# EAGLE design 2AD66-SMA (EAGLE 9.6.2)
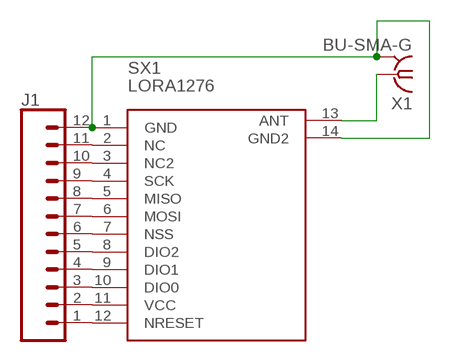
[diagram p0: schematic, sheet 1]

## Parts
J1  CONN_12  [1X12]
SX1  LORA1276  [PCBV2]
X1  BU-SMA-G  [BU-SMA-G]

## Nets
N$1: J1.11 SX1.2(NC)
N$2: J1.10 SX1.3(NC2)
N$3: J1.9 SX1.4(SCK)
N$4: J1.8 SX1.5(MISO)
N$5: J1.7 SX1.6(MOSI)
N$6: J1.6 SX1.7(NSS)
N$7: J1.5 SX1.8(DIO2)
N$8: J1.4 SX1.9(DIO1)
N$9: J1.3 SX1.10(DIO0)
N$10: J1.2 SX1.11(VCC)
N$11: J1.1 SX1.12(NRESET)
N$12: J1.12 SX1.1(GND) SX1.14(GND2) X1.2 X1.3 X1.4 X1.5
N$13: SX1.13(ANT) X1.1

## Library data of the parts
J1 = SparkFun-Connectors:CONN_12: Multi connection point. Often used as Generic Header-pin footprint for 0.1 inch spaced/style header connections On any of the 0.1 inch spaced packages, you can populate with these: Break Away Headers - Straight <https://www.sparkfun.com/products/116> (PRT-00116) Break Away Male Headers - Right Angle <https://www.sparkfun.com/products/553> (PRT-00553) Female Headers <https://www.sparkfun.com/products/115> (PRT-00115) Break Away Headers - Machine Pin <https://www.sparkfun.com/products/117> (PRT-00117) Break Away Female Headers - Swiss Machine Pin <https://www.sparkfun.com/products/743> (PRT-00743) For SCREWTERMINALS and SPRING TERMINALS visit here: Screw Terimnals on SparkFun.com <https://www.sparkfun.com/search/results?term=Screw+Terminals> (5mm/3.5mm/2.54mm spacing) This device is also useful as a general connection point to wire up your design to another part of your project. Our various solder wires solder well into these plated through hole pads. Hook-Up Wire - Assortment (Stranded, 22 AWG) <https://www.sparkfun.com/products/11375> (PRT-11375) Hook-Up Wire - Assortment (Solid Core, 22 AWG) <https://www.sparkfun.com/products/11367> (PRT-11367) View the entire wire category on our website here <https://www.sparkfun.com/categories/141> Special notes: Molex polarized connector foot print use with SKU : PRT-08231 with associated crimp pins and housings. 1MM SMD Version SKU: PRT-10208 NOTES ON THE VARIANTS LOCK and LOCK_LONGPADS... This footprint was designed to help hold the alignment of a through-hole component (i.e. 6-pin header) while soldering it into place. You may notice that each hole has been shifted either up or down by 0.005 of an inch from it's more standard position (which is a perfectly straight line). This slight alteration caused the pins (the squares in the middle) to touch the edges of the holes. Because they are alternating, it causes a "brace" to hold the component in place. 0.005 has proven to be the perfect amount of "off-center" position when using our standard breakaway headers. Although looks a little odd when you look at the bare footprint, once you have a header in there, the alteration is very hard to notice. Also,if you push a header all the way into place, it is covered up entirely on the bottom side.
SX1 = Lora1276V2NiceRF:LORA1276
X1 = con-coax:BU-SMA-G: FEMALE SMA CONNECTOR Radiall distributor RS 193-9117; OC_FARNELL: unknown; OC_NEWARK: unknown

## Board
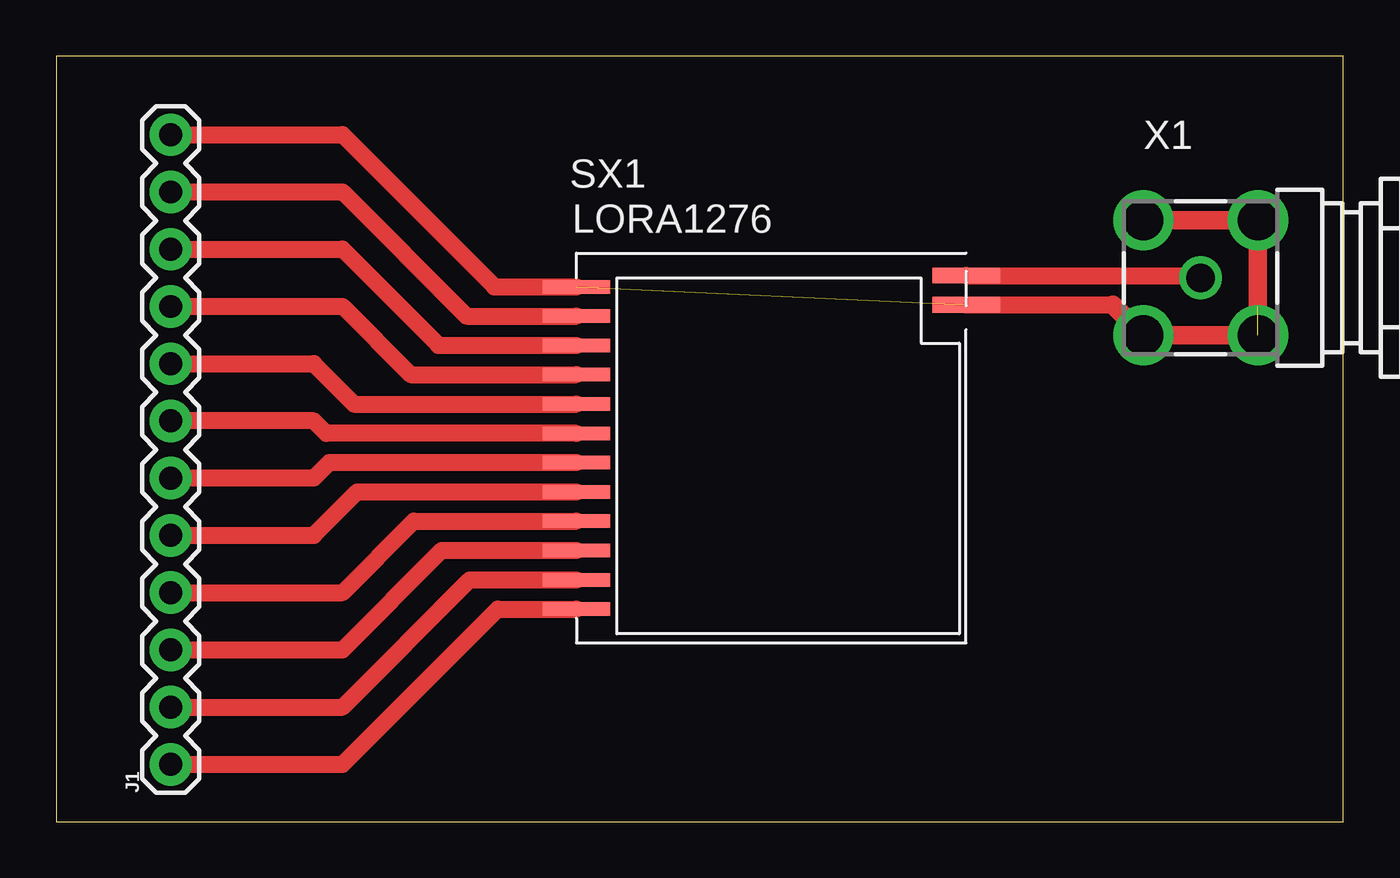
[diagram p1: board, top side]

Size 57.13 x 33.96 mm. Coordinates in mm from the lower left corner, seen from the top.
Outline: 0,0 57.13,0 57.13,33.96 0,33.96 0,0
Copper layers (1*16): Top 0.035mm / dielectric 1.5mm / Bottom 0.035mm
Design rules "default": minimum track width 6mil, minimum drill 0.35mm, track to track 6mil, track to pad 6mil, pad to pad 6mil, via to via 6mil, smd to smd 6mil, copper to edge 40mil, drill to drill 6mil, minimum pad ring 10mil, minimum via ring 8mil, stop-mask expansion 4mil, vias tented up to drill 0mil, thermal gap 10mil

### Footprints (pad centres in the part's own frame; a part is rotated, then mirrored left to right if it is on the bottom)
1X12 = drill 1.016 pad 1.88: 1 0,0; 2 2.54,0; 3 5.08,0; 4 7.62,0; 5 10.16,0; 6 12.7,0; 7 15.24,0; 8 17.78,0; 9 20.32,0; 10 22.86,0; 11 25.4,0; 12 27.94,0
PCBV2 = smd 3 x 0.6: 1 1.5,-0.4; 2 1.5,-1.7; 3 1.5,-3; 4 1.5,-4.3; 5 1.5,-5.6; 6 1.5,-6.9; 7 1.5,-8.2; 8 1.5,-9.5; 9 1.5,-10.8; 10 1.5,-12.1; 11 1.5,-13.4; 12 1.5,-14.7 | smd 3 x 0.7: 13 18.8,0.1; 14 18.8,-1.2
BU-SMA-G = drill 1.27: 1 0,0 | drill 1.778: 2 -2.55,2.55; 3 2.55,2.55; 4 2.55,-2.55; 5 -2.55,-2.55

### Placement (x,y rotation side)
J1  5.08,2.54 90 top
SX1  21.59,24.13 0 top
X1  50.8,24.13 0 top

### Tracks (layer width: path | path; a pad name or v marks a point on that pad's centre or on a via)
N$1
  Top 0.762: J1.11 12.7,27.94 18.21,22.43 SX1.2
N$2
  Top 0.762: J1.10 12.7,25.4 16.97,21.13 SX1.3
N$3
  Top 0.762: J1.9 12.7,22.86 15.73,19.83 SX1.4
N$4
  Top 0.762: J1.8 11.43,20.32 13.22,18.53 SX1.5
N$5
  Top 0.762: SX1.6 11.98,17.23 11.43,17.78 J1.7
N$6
  Top 0.762: SX1.7 12.12,15.93 11.43,15.24 J1.6
N$7
  Top 0.762: SX1.8 13.36,14.63 11.43,12.7 J1.5
N$8
  Top 0.762: SX1.9 15.87,13.33 12.7,10.16 J1.4
N$9
  Top 0.762: SX1.10 17.11,12.03 12.7,7.62 J1.3
N$10
  Top 0.762: J1.2 12.7,5.08 18.35,10.73 SX1.11
N$11
  Top 0.762: SX1.12 19.59,9.43 12.7,2.54 J1.1
N$12  (2 unrouted)
  Top 0.762: J1.12 12.7,30.48 19.45,23.73 SX1.1 | SX1.14 46.9,22.93
  Top 0.813: 46.9,22.93 X1.5 52.07,21.58 | 52.07,21.58 X1.4 | 53.35,22.86 X1.3 X1.2 | 52.08,21.59 52.07,21.58
N$13
  Top 0.762: SX1.13 50.7,24.23
  Top 0.813: 50.7,24.23 X1.1